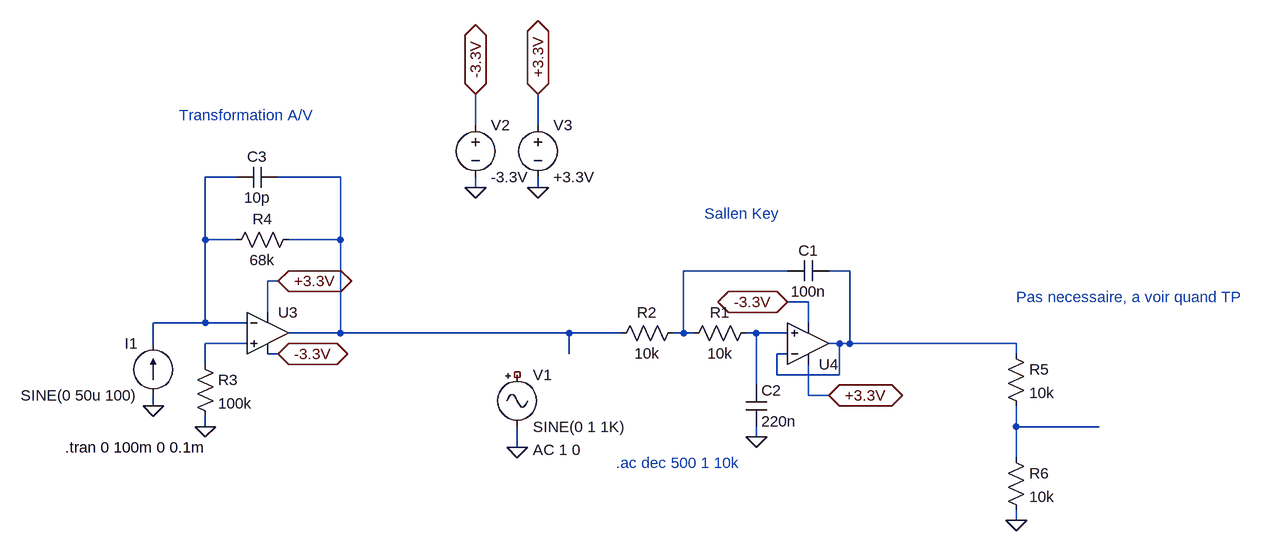
[diagram p0: schematic Luminosité_-Vdd_Vdd.asc]
Luminosité_-Vdd_Vdd.asc, the LTspice schematic file:
Version 4.1
SHEET 1 880 680
WIRE -320 -176 -320 -224
WIRE -224 -176 -224 -224
WIRE -688 -96 -736 -96
WIRE -528 -96 -624 -96
WIRE -320 -80 -320 -96
WIRE -224 -80 -224 -96
WIRE -736 0 -736 -96
WIRE -688 0 -736 0
WIRE -528 0 -528 -96
WIRE -528 0 -608 0
WIRE 160 48 0 48
WIRE 256 48 224 48
WIRE -624 64 -640 64
WIRE 192 96 160 96
WIRE -640 112 -640 64
WIRE -736 128 -736 0
WIRE -736 128 -816 128
WIRE -672 128 -736 128
WIRE 192 128 192 96
WIRE -528 144 -528 0
WIRE -528 144 -608 144
WIRE -176 144 -528 144
WIRE -96 144 -176 144
WIRE 0 144 0 48
WIRE 0 144 -16 144
WIRE 16 144 0 144
WIRE 112 144 96 144
WIRE 160 144 112 144
WIRE -816 160 -816 128
WIRE -672 160 -736 160
WIRE 240 160 224 160
WIRE 256 160 256 48
WIRE 256 160 240 160
WIRE 512 160 256 160
WIRE -624 176 -640 176
WIRE -176 176 -176 144
WIRE 160 176 144 176
WIRE 512 176 512 160
WIRE -736 192 -736 160
WIRE 144 208 144 176
WIRE 240 208 240 160
WIRE 240 208 144 208
WIRE 112 224 112 144
WIRE 192 240 192 192
WIRE 224 240 192 240
WIRE -816 256 -816 240
WIRE -736 288 -736 272
WIRE 512 288 512 256
WIRE 640 288 512 288
WIRE 112 304 112 288
WIRE -256 320 -256 288
WIRE 512 336 512 288
WIRE 512 432 512 416
FLAG 112 304 0
FLAG -256 320 0
FLAG -736 288 0
FLAG -816 256 0
FLAG 512 432 0
FLAG -224 -224 +3.3V
IOPIN -224 -224 BiDir
FLAG -320 -224 -3.3V
IOPIN -320 -224 BiDir
FLAG -624 64 +3.3V
IOPIN -624 64 BiDir
FLAG 224 240 +3.3V
IOPIN 224 240 BiDir
FLAG -624 176 -3.3V
IOPIN -624 176 BiDir
FLAG 160 96 -3.3V
IOPIN 160 96 BiDir
FLAG -320 -80 0
FLAG -224 -80 0
SYMBOL cap 224 32 R90
WINDOW 0 0 32 VBottom 2
WINDOW 3 32 32 VTop 2
SYMATTR InstName C1
SYMATTR Value 100n
SYMBOL res 112 128 R90
WINDOW 0 0 56 VBottom 2
WINDOW 3 32 56 VTop 2
SYMATTR InstName R1
SYMATTR Value 10k
SYMBOL res 0 128 R90
WINDOW 0 0 56 VBottom 2
WINDOW 3 32 56 VTop 2
SYMATTR InstName R2
SYMATTR Value 10k
SYMBOL cap 96 224 R0
SYMATTR InstName C2
SYMATTR Value 220n
SYMBOL Misc\\signal -256 192 R0
WINDOW 123 24 132 Left 2
WINDOW 39 0 0 Left 0
SYMATTR Value2 AC 1 0
SYMATTR InstName V1
SYMBOL res -752 176 R0
SYMATTR InstName R3
SYMATTR Value 100k
SYMBOL res -592 -16 R90
WINDOW 0 0 56 VBottom 2
WINDOW 3 32 56 VTop 2
SYMATTR InstName R4
SYMATTR Value 68k
SYMBOL cap -624 -112 R90
WINDOW 0 0 32 VBottom 2
WINDOW 3 32 32 VTop 2
SYMATTR InstName C3
SYMATTR Value 10p
SYMBOL current -816 240 R180
WINDOW 0 24 80 Left 2
WINDOW 3 24 0 Left 2
WINDOW 123 0 0 Left 0
WINDOW 39 0 0 Left 0
SYMATTR InstName I1
SYMATTR Value SINE(0 50u 100)
SYMBOL res 496 160 R0
SYMATTR InstName R5
SYMATTR Value 10k
SYMBOL res 496 320 R0
SYMATTR InstName R6
SYMATTR Value 10k
SYMBOL voltage -320 -192 R0
WINDOW 123 0 0 Left 0
WINDOW 39 0 0 Left 0
SYMATTR InstName V2
SYMATTR Value -3.3V
SYMBOL voltage -224 -192 R0
WINDOW 123 0 0 Left 0
WINDOW 39 0 0 Left 0
SYMATTR InstName V3
SYMATTR Value +3.3V
SYMBOL OpAmps\\UniversalOpAmp2 -640 144 R0
SYMATTR InstName U3
SYMBOL OpAmps\\UniversalOpAmp2 192 160 M180
SYMATTR InstName U4
TEXT -104 344 Left 2 ;.ac dec 500 1 10k
TEXT 32 -40 Left 2 ;Sallen Key
TEXT -952 320 Left 2 !.tran 0 100m 0 0.1m
TEXT -776 -192 Left 2 ;Transformation A/V
TEXT 512 88 Left 2 ;Pas necessaire, a voir quand TP

The netlist it stands for:
* Luminosité_-Vdd_Vdd.asc
C1 N004 N003 100n
R1 N005 N003 10k
R2 N003 N002 10k
C2 N005 0 220n
V1 NC_01 0 SINE(0 1 1K) AC 1 0
R3 N006 0 100k
R4 N002 N001 68k
C3 N002 N001 10p
I1 0 N001 SINE(0 50u 100)
R5 N004 N007 10k
R6 N007 0 10k
V2 -3.3V 0 -3.3V
V3 +3.3V 0 +3.3V
X§U3 N006 N001 +3.3V -3.3V N002 level2 Avol=1Meg GBW=10Meg Slew=10Meg Ilimit=25m Rail=0 Vos=0 En=0 Enk=0 In=0 Ink=0 Rin=500Meg  ; pins In+ In- V+ V- OUT
X§U4 N005 N004 +3.3V -3.3V N004 level2 Avol=1Meg GBW=10Meg Slew=10Meg Ilimit=25m Rail=0 Vos=0 En=0 Enk=0 In=0 Ink=0 Rin=500Meg  ; pins In+ In- V+ V- OUT
* .ac dec 500 1 10k
* Sallen Key
.tran 0 100m 0 0.1m
* Transformation A/V
* Pas necessaire, a voir quand TP
.lib UniversalOpAmp2.lib
.backanno
.end